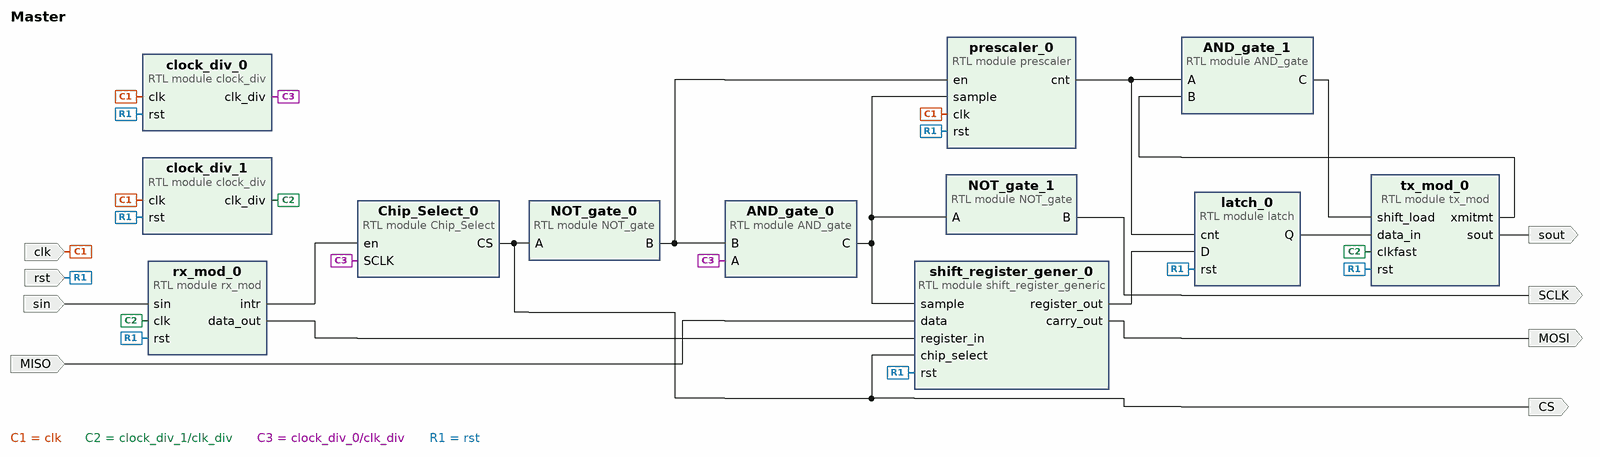
[diagram p0: block diagram of the top level]
# Vivado block design Master, xc7z020clg400-1, Vivado 2023.2
create_bd_design Master

create_bd_port -dir I -type clk clk
create_bd_port -dir I -type rst rst
create_bd_port -dir I MISO
create_bd_port -dir O MOSI
create_bd_port -dir O CS
create_bd_port -dir I sin
create_bd_port -dir O sout
create_bd_port -dir O SCLK

create_bd_cell -type module -reference shift_register_generic shift_register_gener_0
set_property -dict {CONFIG.register_length 8} [get_bd_cells shift_register_gener_0]
create_bd_cell -type module -reference latch latch_0
set_property -dict {CONFIG.data_length 8} [get_bd_cells latch_0]
create_bd_cell -type module -reference prescaler prescaler_0
set_property -dict {CONFIG.data_length 8} [get_bd_cells prescaler_0]
create_bd_cell -type module -reference Chip_Select Chip_Select_0
create_bd_cell -type module -reference NOT_gate NOT_gate_0
create_bd_cell -type module -reference rx_mod rx_mod_0
create_bd_cell -type module -reference tx_mod tx_mod_0
create_bd_cell -type module -reference clock_div clock_div_0
set_property -dict {CONFIG.half_val 4096 CONFIG.n_bits 13} [get_bd_cells clock_div_0]
create_bd_cell -type module -reference clock_div clock_div_1
set_property -dict {CONFIG.half_val 407 CONFIG.n_bits 10} [get_bd_cells clock_div_1]
create_bd_cell -type module -reference AND_gate AND_gate_0
create_bd_cell -type module -reference AND_gate AND_gate_1
create_bd_cell -type module -reference NOT_gate NOT_gate_1

# ---- connections ----

connect_bd_net [get_bd_pins AND_gate_0/C] [get_bd_pins NOT_gate_1/A] [get_bd_pins shift_register_gener_0/sample] [get_bd_pins prescaler_0/sample]
connect_bd_net [get_bd_pins AND_gate_1/C] [get_bd_pins tx_mod_0/shift_load]
connect_bd_net [get_bd_pins Chip_Select_0/CS] [get_bd_ports CS] [get_bd_pins NOT_gate_0/A] [get_bd_pins shift_register_gener_0/chip_select]
connect_bd_net [get_bd_ports MISO] [get_bd_pins shift_register_gener_0/data]
connect_bd_net [get_bd_pins NOT_gate_0/B] [get_bd_pins AND_gate_0/B] [get_bd_pins prescaler_0/en]
connect_bd_net [get_bd_pins NOT_gate_1/B] [get_bd_ports SCLK]
connect_bd_net [get_bd_ports clk] [get_bd_pins clock_div_0/clk] [get_bd_pins clock_div_1/clk] [get_bd_pins prescaler_0/clk]
connect_bd_net -net clk_div_0_clk_div [get_bd_pins clock_div_1/clk_div] [get_bd_pins rx_mod_0/clk] [get_bd_pins tx_mod_0/clkfast]
connect_bd_net [get_bd_pins clock_div_0/clk_div] [get_bd_pins Chip_Select_0/SCLK] [get_bd_pins AND_gate_0/A]
connect_bd_net [get_bd_pins latch_0/Q] [get_bd_pins tx_mod_0/data_in]
connect_bd_net [get_bd_pins prescaler_0/cnt] [get_bd_pins latch_0/cnt] [get_bd_pins AND_gate_1/A]
connect_bd_net -net rst_0_1 [get_bd_ports rst] \
  [get_bd_pins shift_register_gener_0/rst] [get_bd_pins latch_0/rst] [get_bd_pins rx_mod_0/rst] [get_bd_pins tx_mod_0/rst] \
  [get_bd_pins clock_div_0/rst] [get_bd_pins clock_div_1/rst] [get_bd_pins prescaler_0/rst]
connect_bd_net [get_bd_pins rx_mod_0/data_out] [get_bd_pins shift_register_gener_0/register_in]
connect_bd_net [get_bd_pins rx_mod_0/intr] [get_bd_pins Chip_Select_0/en]
connect_bd_net [get_bd_pins shift_register_gener_0/carry_out] [get_bd_ports MOSI]
connect_bd_net [get_bd_pins shift_register_gener_0/register_out] [get_bd_pins latch_0/D]
connect_bd_net [get_bd_ports sin] [get_bd_pins rx_mod_0/sin]
connect_bd_net [get_bd_pins tx_mod_0/sout] [get_bd_ports sout]
connect_bd_net [get_bd_pins tx_mod_0/xmitmt] [get_bd_pins AND_gate_1/B]

validate_bd_design
save_bd_design
